# EAGLE design p02 (EAGLE 8.4.2)
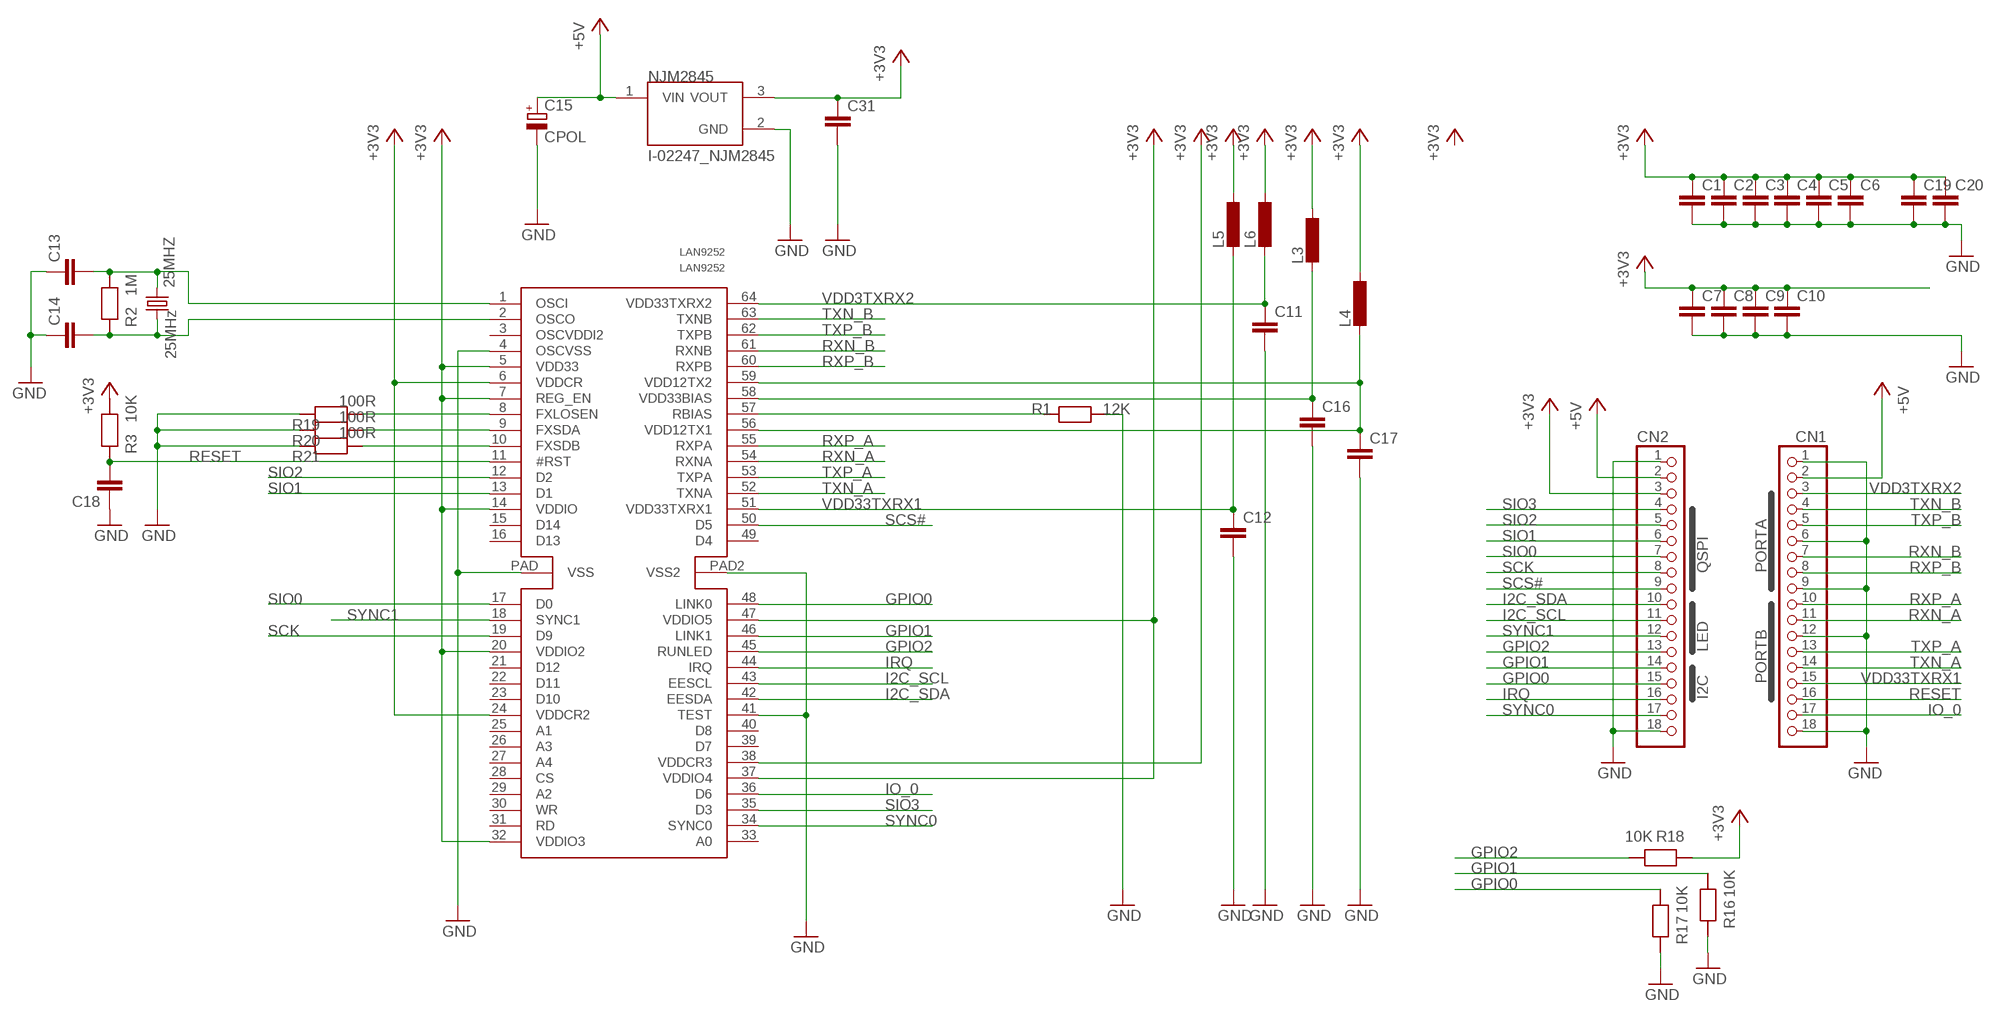
[diagram p0: schematic, sheet 1]

## Parts
25MHZ  25MHz  CRYSTALHC49S  [HC49/S]
C1  C_1068  [C0603]
C2  C_1068  [C0603]
C3  C_1068  [C0603]
C4  C_1068  [C0603]
C5  C_1068  [C0603]
C6  C_1068  [C0603]
C7  C_1068  [C0603]
C8  C_1068  [C0603]
C9  C_1068  [C0603]
C10  C_1068  [C0603]
C11  C_1068  [C0603]
C12  C_1068  [C0603]
C13  C_1068  [C0603]
C14  C_1068  [C0603]
C15  CPOL  [153CLV-0605]
C16  C_1068  [C0603]
C17  C_1068  [C0603]
C18  C_1068  [C0603]
C19  C_2012  [C0805K]
C20  C_2012  [C0805K]
C31  C_1068  [C0603]
CN1  PINHD-1X18  [1X18]
CN2  PINHD-1X18  [1X18]
L3  L-EUL2012C  [L2012C]
L4  L-EUL2012C  [L2012C]
L5  L-EUL2012C  [L2012C]
L6  L-EUL2012C  [L2012C]
LAN9252  LAN9252  [QFN-64_02]
NJM2845  I-02247_NJM2845  [TO252]
R1  12K  R_1068  [R0603]
R2  1M  R_1068  [R0603]
R3  10K  R_1068  [R0603]
R16  10K  R_1068  [R0603]
R17  10K  R_1068  [R0603]
R18  10K  R_1068  [R0603]
R19  100R  R_1068  [R0603]
R20  100R  R_1068  [R0603]
R21  100R  R_1068  [R0603]

## Nets
+3V3: C1.1 C2.1 C3.1 C4.1 C5.1 C6.1 C7.1 C8.1 C9.1 C10.1 C19.1 C20.1 C31.1 CN2.3 L3.1 L4.1 L5.1 L6.1 LAN9252.5(VDD33) LAN9252.6(VDDCR) LAN9252.7(REG_EN) LAN9252.14(VDDIO) LAN9252.20(VDDIO2) LAN9252.24(VDDCR2) LAN9252.32(VDDIO3) LAN9252.37(VDDIO4) LAN9252.38(VDDCR3) LAN9252.47(VDDIO5) NJM2845.3(VOUT) R3.2 R18.1
+5V: C15.+ CN1.2 CN2.2 NJM2845.1(VIN)
GND: C1.2 C2.2 C3.2 C4.2 C5.2 C6.2 C7.2 C8.2 C9.2 C10.2 C11.2 C12.2 C13.1 C14.1 C15.- C16.2 C17.2 C18.1 C19.2 C20.2 C31.2 CN1.1 CN1.6 CN1.9 CN1.12 CN1.18 CN2.1 CN2.18 LAN9252.4(OSCVSS) LAN9252.41(TEST) LAN9252.PAD2(VSS2) LAN9252.PAD(VSS) NJM2845.2(GND) R1.1 R16.1 R17.1 R19.1 R20.1 R21.1
GPIO0: CN2.15 LAN9252.48(LINK0) R17.2
GPIO1: CN2.14 LAN9252.46(LINK1) R16.2
GPIO2: CN2.13 LAN9252.45(RUNLED) R18.2
I2C_SCL: CN2.11 LAN9252.43(EESCL)
I2C_SDA: CN2.10 LAN9252.42(EESDA)
IO_0: CN1.17 LAN9252.36(D6)
IRQ: CN2.16 LAN9252.44(IRQ)
N$1: LAN9252.57(RBIAS) R1.2
N$2: LAN9252.8(FXLOSEN) R19.2
N$3: LAN9252.9(FXSDA) R20.2
N$4: 25MHZ.2 C13.2 LAN9252.1(OSCI) R2.2
N$5: C17.1 L4.2 LAN9252.56(VDD12TX1) LAN9252.59(VDD12TX2)
N$6: 25MHZ.1 C14.2 LAN9252.2(OSCO) R2.1
N$7: LAN9252.10(FXSDB) R21.2
N$8: C16.1 L3.2 LAN9252.58(VDD33BIAS)
RESET: C18.2 CN1.16 LAN9252.11(#RST) R3.1
RXN_A: CN1.11 LAN9252.54(RXNA)
RXN_B: CN1.7 LAN9252.61(RXNB)
RXP_A: CN1.10 LAN9252.55(RXPA)
RXP_B: CN1.8 LAN9252.60(RXPB)
SCK: CN2.8 LAN9252.19(D9)
SCS#: CN2.9 LAN9252.50(D5)
SIO0: CN2.7 LAN9252.17(D0)
SIO1: CN2.6 LAN9252.13(D1)
SIO2: CN2.5 LAN9252.12(D2)
SIO3: CN2.4 LAN9252.35(D3)
SYNC0: CN2.17 LAN9252.34(SYNC0)
SYNC1: CN2.12 LAN9252.18(SYNC1)
TXN_A: CN1.14 LAN9252.52(TXNA)
TXN_B: CN1.4 LAN9252.63(TXNB)
TXP_A: CN1.13 LAN9252.53(TXPA)
TXP_B: CN1.5 LAN9252.62(TXPB)
VDD3TXRX2: C11.1 CN1.3 L6.2 LAN9252.64(VDD33TXRX2)
VDD33TXRX1: C12.1 CN1.15 L5.2 LAN9252.51(VDD33TXRX1)
Unconnected: LAN9252.3(OSCVDDI2) LAN9252.15(D14) LAN9252.16(D13) LAN9252.21(D12) LAN9252.22(D11) LAN9252.23(D10) LAN9252.25(A1) LAN9252.26(A3) LAN9252.27(A4) LAN9252.28(CS) LAN9252.29(A2) LAN9252.30(WR) LAN9252.31(RD) LAN9252.33(A0) LAN9252.39(D7) LAN9252.40(D8) LAN9252.49(D4)

## Notes on the sheet
- QSPI | PORTA
- LED
- PORTB
- I2C

## Library data of the parts
25MHZ = crystal:CRYSTAL: CRYSTAL; OC_FARNELL: 1667008; OC_NEWARK: unknown
C1-C14 C16-C18 C31 = LAN9252:C_1068
C15 = MyPacklbr:CPOL
C19 C20 = LAN9252:C_2012
CN1 CN2 = pinhead:PINHD-1X18: PIN HEADER
L3-L6 = rcl:L-EU: INDUCTOR, European symbol
LAN9252 = LAN9252:LAN9252
NJM2845 = Akizuki:I-02247_NJM2845
R1-R3 R16-R21 = MyPacklbr:R_1068

## Board
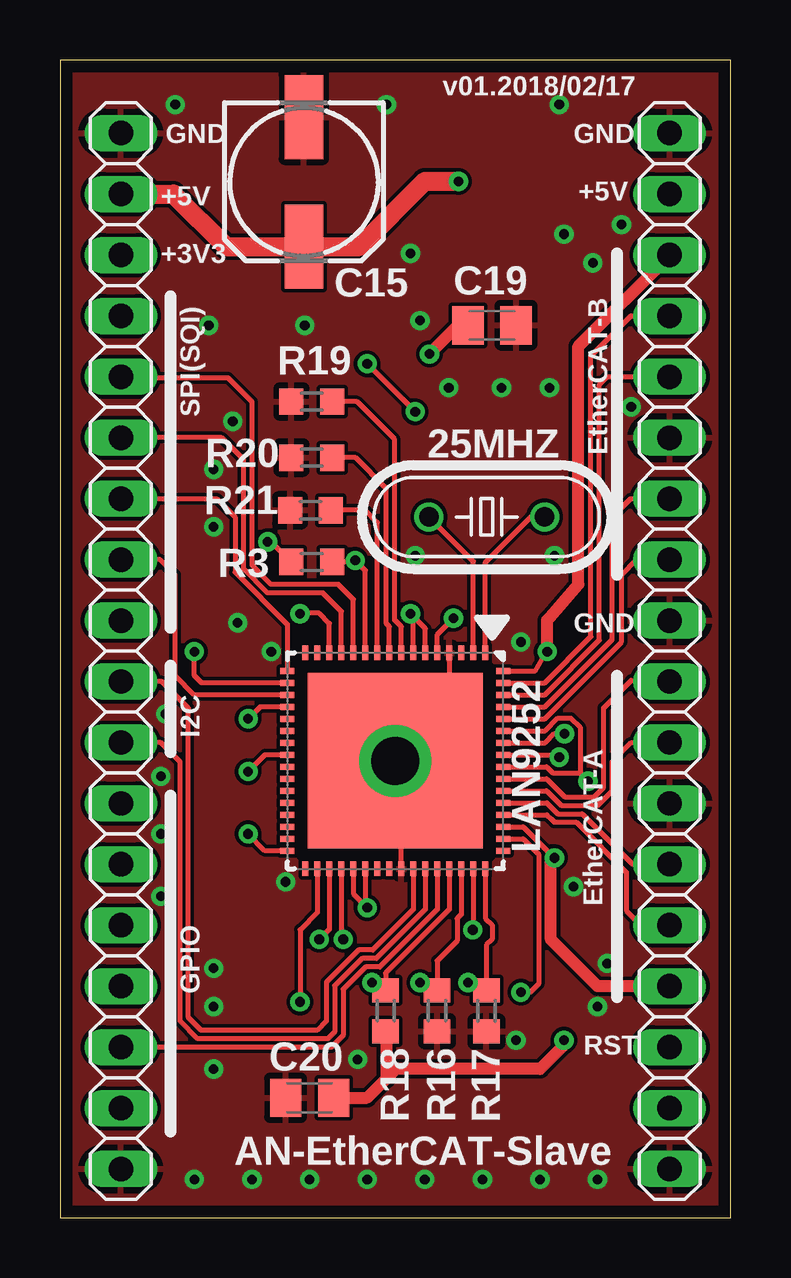
[diagram p1: board, top side]
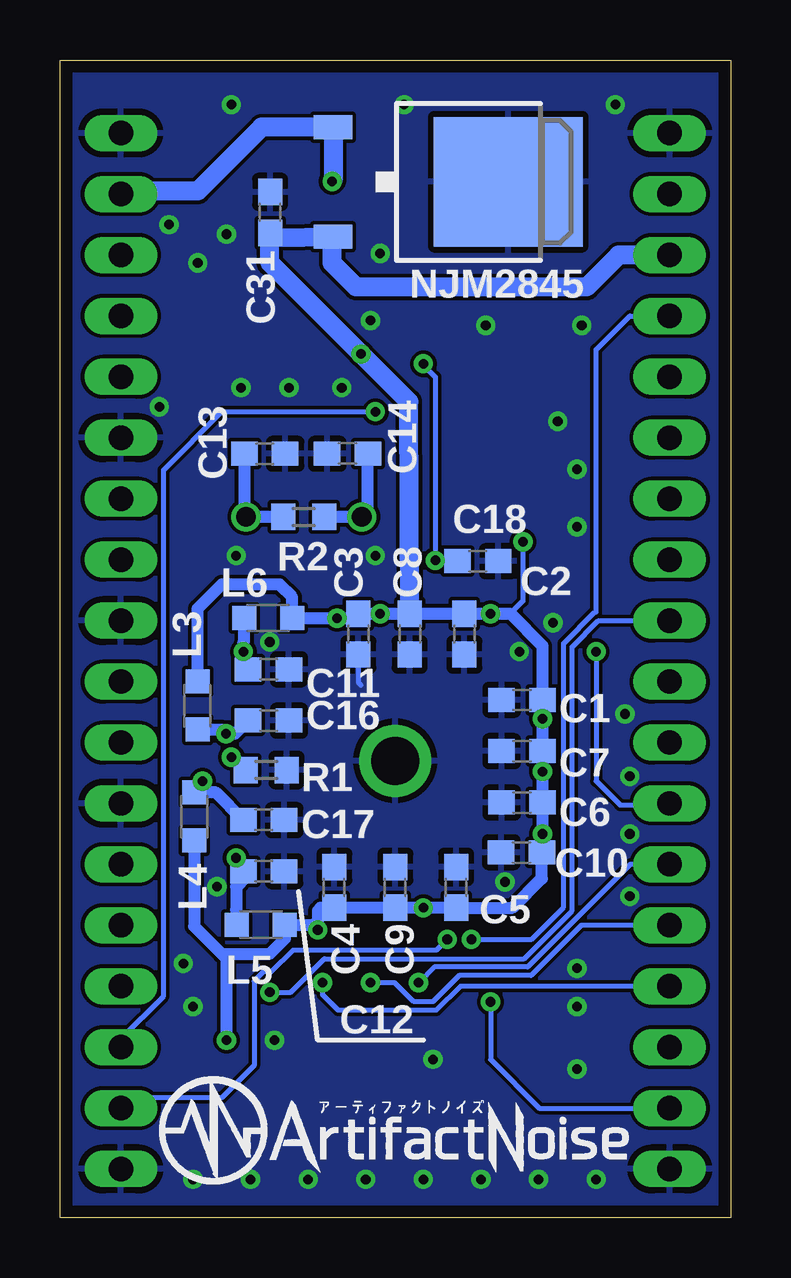
[diagram p2: board, bottom side, seen from below]

Size 27.94 x 48.26 mm. Coordinates in mm from the lower left corner, seen from the top.
Outline: 0,0 27.94,0 27.94,48.26 0,48.26 0,0
Copper layers (1*16): Top 0.035mm / dielectric 1.6mm / Bottom 0.035mm
Design rules "Elecrow_2-layer_PCB_eagle_rule": minimum track width 6mil, minimum drill 12mil, track to track 6mil, track to pad 6mil, pad to pad 6mil, via to via 8mil, smd to smd 0mil, copper to edge 20mil, drill to drill 10mil, minimum pad ring 6mil, minimum via ring 6mil, stop-mask expansion 0mil, vias tented up to drill 100mil, thermal gap 10mil
tKeepout: 1 lines
tRestrict: 4 lines

### Footprints (pad centres in the part's own frame; a part is rotated, then mirrored left to right if it is on the bottom)
HC49/S = drill 0.813: 1 -2.413,0; 2 2.413,0
C0603 = smd 1.1 x 1: 1 -0.85,0; 2 0.85,0
153CLV-0605 = smd 3.5 x 1.6: + 2.7,0; - -2.7,0
C0805K = smd 1.3 x 1.6: 1 -1,0; 2 1,0
1X18 = drill 1.016 long: 1 -21.59,0; 2 -19.05,0; 3 -16.51,0; 4 -13.97,0; 5 -11.43,0; 6 -8.89,0; 7 -6.35,0; 8 -3.81,0; 9 -1.27,0; 10 1.27,0; 11 3.81,0; 12 6.35,0; 13 8.89,0; 14 11.43,0; 15 13.97,0; 16 16.51,0; 17 19.05,0; 18 21.59,0
L2012C = smd 1 x 1: 1 -1,0; 2 1,0
QFN-64_02 = smd 0.6 x 0.25: 1 -4.5,3.75; 2 -4.5,3.25; 3 -4.5,2.75; 4 -4.5,2.25; 5 -4.5,1.75; 6 -4.5,1.25; 7 -4.5,0.75; 8 -4.5,0.25; 9 -4.5,-0.25; 10 -4.5,-0.75; 11 -4.5,-1.25; 12 -4.5,-1.75; 13 -4.5,-2.25; 14 -4.5,-2.75; 15 -4.5,-3.25; 16 -4.5,-3.75; 33 4.5,-3.75; 34 4.5,-3.25; 35 4.5,-2.75; 36 4.5,-2.25; 37 4.5,-1.75; 38 4.5,-1.25; 39 4.5,-0.75; 40 4.5,-0.25; 41 4.5,0.25; 42 4.5,0.75; 43 4.5,1.25; 44 4.5,1.75; 45 4.5,2.25; 46 4.5,2.75; 47 4.5,3.25; 48 4.5,3.75 | smd 0.25 x 0.6: 17 -3.75,-4.5; 18 -3.25,-4.5; 19 -2.75,-4.5; 20 -2.25,-4.5; 21 -1.75,-4.5; 22 -1.25,-4.5; 23 -0.75,-4.5; 24 -0.25,-4.5; 25 0.25,-4.5; 26 0.75,-4.5; 27 1.25,-4.5; 28 1.75,-4.5; 29 2.25,-4.5; 30 2.75,-4.5; 31 3.25,-4.5; 32 3.75,-4.5; 49 3.75,4.5; 50 3.25,4.5; 51 2.75,4.5; 52 2.25,4.5; 53 1.75,4.5; 54 1.25,4.5; 55 0.75,4.5; 56 0.25,4.5; 57 -0.25,4.5; 58 -0.75,4.5; 59 -1.25,4.5; 60 -1.75,4.5; 61 -2.25,4.5; 62 -2.75,4.5; 63 -3.25,4.5; 64 -3.75,4.5 | smd 7.3 x 7.3: PAD 0,0 | drill 2: PAD2 0,0
TO252 = smd 1 x 1.6: 1 -2.28,-4.8; 3 2.28,-4.8 | smd 5.4 x 6.2: 2 0,2.5
R0603 = smd 1 x 1.1: 1 -0.85,0; 2 0.85,0

### Placement (x,y rotation side)
25MHZ  17.78,29.21 0 top
C1  8.69,21.59 180 bottom
C2  11.09,24.33 270 bottom
C3  15.51,24.33 270 bottom
C4  16.51,13.77 90 bottom
C5  11.43,13.77 90 bottom
C6  8.69,17.31 180 bottom
C7  8.69,19.45 180 bottom
C8  13.37,24.33 270 bottom
C9  13.97,13.77 90 bottom
C10  8.71,15.23 180 bottom
C11  19.25,22.86 0 bottom
C12  19.45,14.44 0 bottom
C13  19.41,31.85 180 bottom
C14  15.96,31.85 0 bottom
C15  10.16,43.18 270 top
C16  19.25,20.72 0 bottom
C17  19.45,16.58 0 bottom
C18  10.53,27.37 180 bottom
C19  18,37.2 0 top
C20  10.4,5 180 top
C31  19.18,41.91 90 bottom
CN1  25.4,23.62 270 top
CN2  2.54,23.62 270 top
L3  22.21,21.35 270 bottom
L4  22.35,16.72 90 bottom
L5  19.57,12.21 180 bottom
L6  19.27,24.99 180 bottom
LAN9252  13.97,19.05 270 top
NJM2845  11.76,43.18 270 bottom
R1  19.35,18.66 180 bottom
R2  17.78,29.21 180 bottom
R3  10.49,27.34 180 top
R16  15.71,8.63 90 top
R17  17.77,8.62 90 top
R18  13.57,8.63 90 top
R19  10.49,34.02 0 top
R20  10.49,31.68 0 top
R21  10.44,29.49 0 top
U$1  [AN-LOGO2]  23.8,1.4 0 bottom

### Tracks (layer width: path | path; a pad name or v marks a point on that pad's centre or on a via)
+3V3  (via drill 0.4 pad 0.8)
  Top 0.2: LAN9252.6 15.22,24.56 v14.6,25.18 14.72,25.06 LAN9252.7 | LAN9252.5 15.72,24.31 v16.4,24.99 | LAN9252.47 17.22,12.82 v17.2,12 | LAN9252.38 12.72,13 | 12.72,13 v12.8,12.92 | LAN9252.37 12.22,13.5 12.72,13 | LAN9252.32 8.54,15.3 v7.84,16 | LAN9252.24 8.54,19.3 v7.84,18.6 | LAN9252.20 8.34,21.3 v7.84,20.8 | R3.2 8.81,28.17 v8.65,28.17 | v10,25.18 10.02,25.2 10.8,25.2 11.22,24.78 LAN9252.14
  Top 0.5: R18.1 13.6,7.75 13.6,5.8 | v21,7.4 21,7.2 20,6.2 14,6.2 13.6,5.8 | C20.1 12.8,5 13.6,5.8 | C19.1 16.59,37.2 v15.39,36.01
  Bottom 0.2: v8.65,28.17 8.65,25.71 9.18,25.18
  Bottom 0.5: L3.1 22.21,25.39 21.2,26.4 18.8,26.4 18.27,25.87 L6.1 v16.4,24.99 15.7,24.99 C3.1 v14.6,25.18 C8.1 C2.1 v10,25.18 9.18,25.18 7.84,23.84 C1.1 v7.84,20.8 C7.1 v7.84,18.6 C6.1 v7.84,16 7.84,15.25 C10.1 7.86,14.14 9.08,12.92 C5.1 v12.8,12.92 C9.1 C4.1 17.08,12.92 17.2,12.8 v17.2,12 17.41,12.21 L5.1 18.57,11.63 19.2,11 21.2,11 | L4.1 22.35,12.15 21.2,11 | v21,7.4 21,10.8 21.2,11
  Bottom 0.8: CN2.3 4.67,40.13 6,38.8 15.6,38.8 16.6,39.8 16.6,40.86 NJM2845.3 18.92,40.86 C31.1 19.2,41.04 19.2,39.8 19.19,39.8 v15.39,36.01 13.41,34.02 C8.1
+5V  (via drill 0.4 pad 0.8)
  Top 0.8: CN2.2 4.73,42.67 6.92,40.48 C15.+ 12.48,40.48 15.2,43.2 v16.6,43.2
  Bottom 0.8: CN1.2 25.27,42.8 22.2,42.8 19.54,45.46 NJM2845.1 16.56,43.24 v16.6,43.2
GND  (via drill 0.4 pad 0.8)
  Top 0.2: 14.06,19.14 15.72,20.8 | 15.72,20.8 16.2,20.8 | LAN9252.4 16.22,21.3 15.72,20.8 | 14.06,19.14 LAN9252.PAD2 | LAN9252.41 14.22,18.98 14.06,19.14
  Bottom 0.2: C3.2 15.51,22.31 15.4,22.2
  Bottom 0.5: 13.38,19.05 LAN9252.PAD2 13.57,19.45
  other vias: 6.4,8.8 6.4,10.4 5.6,1.6 8,1.6 10.4,1.6 12.8,1.6 15.2,1.6 17.6,1.6 20,1.6 22.4,1.6 19,7.4 4.8,46.4 13.6,46.4 20.8,46.4 6.2,37.2 15,37.4 14.6,40.2 21,41 20.4,34.6 16.2,34.6 7.2,33.2 6.4,31.2 6.4,28.8 7.4,24.8 10.2,37.2 18.4,34.6 14.8,27.6 19.2,24 8.8,23.6 9.4,14 22.8,10.6 21.4,13.8 6.4,6.2 12.4,6.6 22.4,8.8 4.2,18.4 4.4,21 4.2,16 4.2,13.4 23.8,33.8 23.4,41.4 22.2,39.8 20.6,27.6
  pour Bottom: 0,0 0,48.4 28,48.4 28,0
  pour Top: 0,0 0,48.4 28,48.4 28,0
GPIO0  (via drill 0.4 pad 0.8)
  Top 0.2: LAN9252.48 17.72,12.48 18,12.2 18,11.6 17.77,11.37 17.77,9.8 | 17.77,9.8 R17.2 | v17,9.8 17.77,9.8
  Bottom 0.2: CN2.15 11.25,9.65 12.25,8.65 16.35,8.65 17,9.29 v17,9.8
GPIO1  (via drill 0.4 pad 0.8)
  Top 0.2: 15.71,9.8 15.71,10.71 16.55,11.55 16.55,12.47 16.72,12.64 LAN9252.46 | 15.71,9.8 R16.2 | v15,9.8 15.71,9.8
  Bottom 0.2: CN2.14 6.21,12.19 8.31,10.1 11.3,10.1 12.4,9 13.2,9 14,9.8 v15,9.8
GPIO2  (via drill 0.4 pad 0.8)
  Top 0.2: 13.57,9.8 13.57,10.2 16.18,12.81 16.2,12.82 16.22,12.85 LAN9252.45 | 13.57,9.8 R18.2 | v13,9.8 13.57,9.8
  Bottom 0.2: v13,9.8 12.35,10.45 8.45,10.45 4.17,14.73 CN2.13
I2C_SCL
  Top 0.2: CN2.11 4.19,19.81 5,19 5,12.6 5,12.4 5,8.2 5.74,7.46 11.17,7.46 11.45,7.75 11.45,9.67 12.58,10.8 13.18,10.8 15.22,12.85 LAN9252.43
I2C_SDA
  Top 0.2: CN2.10 4.25,22.35 5.35,21.25 5.35,8.35 5.88,7.82 10.71,7.82 11.1,8.2 11.1,9.81 12.44,11.16 13.03,11.16 14.72,12.85 LAN9252.42
IO_0  (via drill 0.4 pad 0.8)
  Top 0.2: LAN9252.36 11.72,11.69 v11.8,11.61
  Bottom 0.2: v11.8,11.61 12.26,11.15 18.23,11.15 19.13,10.25 19.47,10.25 19.85,9.87 19.85,6.35 21.2,5 24.97,5 CN1.17
IRQ
  Top 0.2: CN2.16 11.31,7.11 11.8,7.6 11.8,9.52 12.73,10.45 13.32,10.45 15.72,12.85 LAN9252.44
N$1  (via drill 0.4 pad 0.8)
  Top 0.2: LAN9252.57 20.7,19.3 v20.8,19.2
  Bottom 0.5: R1.2 20.26,18.66 v20.8,19.2
N$2
  Top 0.2: LAN9252.8 14.22,24.64 13.95,24.91 13.95,32.45 12.38,34.02 R19.2
N$3
  Top 0.2: LAN9252.9 13.72,24.64 13.6,24.76 13.6,30.41 12.32,31.68 R20.2
N$4
  Top 0.2: LAN9252.1 17.72,27.32 19.61,29.21 25MHZ.2
  Bottom 0.5: R2.2 25MHZ.2 20.26,29.28 C13.2
N$5  (via drill 0.4 pad 0.8)
  Top 0.2: LAN9252.56 20.28,18.8 20.53,18.55 21.65,18.55 21.67,18.53 | 21.67,18.53 v22,18.2 | 21.67,18.53 21.67,20.45 21.29,20.83 20.75,20.83 20.22,20.3 LAN9252.59
  Bottom 0.2: v22,18.2 22.35,17.85 L4.2
  Bottom 0.5: C17.1 21.44,17.72 L4.2
N$6
  Top 0.2: LAN9252.2 17.22,27.36 25MHZ.1
  Bottom 0.5: C14.2 15.11,29.47 25MHZ.1 R2.1
N$7
  Top 0.2: LAN9252.10 13.22,28.98 12.71,29.49 R21.2
N$8  (via drill 0.4 pad 0.8)
  Top 0.2: LAN9252.58 20.22,19.8 20.6,20.18 v21.02,20.18
  Bottom 0.5: C16.1 20.64,20.18 v21.02,20.18 21.19,20.35 L3.2
RESET  (via drill 0.4 pad 0.8)
  Top 0.2: R3.1 12.24,27.34 v12.3,27.4 12.72,26.98 LAN9252.11 | v14.8,33.6 v12.8,35.6
  Bottom 0.2: CN1.16 25.4,7.46 23.62,9.23 23.62,31.18 21.2,33.6 v14.8,33.6 | v12.8,35.6 12.8,35.55 12.3,35.05 v12.3,27.4 11.41,27.4 C18.2
RXN_A
  Top 0.2: LAN9252.54 20.28,17.8 20.89,17.2 22.42,17.2 23,17.78 23,19 23.81,19.81 CN1.11
RXN_B
  Top 0.2: CN1.7 23.77,29.97 23,29.2 23,24.1 20.2,21.3 LAN9252.61
RXP_A
  Top 0.2: LAN9252.55 20.28,18.3 21.03,17.55 22.27,17.55 22.65,17.93 22.65,21.25 23.8,22.4 25.35,22.4 CN1.10
RXP_B
  Top 0.2: LAN9252.60 20.2,20.8 23.4,24 23.4,26.8 24.03,27.43 CN1.8
SCK
  Top 0.2: CN2.8 4.17,27.43 4.8,26.8 4.8,22.6 5.6,21.8 LAN9252.19
SCS#  (via drill 0.4 pad 0.8)
  Top 0.2: LAN9252.50 19.3,15.8 19.95,15.15 19.95,9.75 19.6,9.4 v19.2,9.4
  Bottom 0.2: CN2.9 5.51,24.89 6.6,23.8 6.6,12.8 8.6,10.8 16.92,10.8 18.32,9.4 v19.2,9.4
SIO0
  Top 0.2: CN2.7 6.52,29.97 7.29,29.2 7.29,26.91 9.47,24.73 LAN9252.17
SIO1
  Top 0.2: LAN9252.13 11.72,25.28 10.95,26.05 8.65,26.05 7.65,27.05 7.65,31.6 6.74,32.51 CN2.6
SIO2
  Top 0.2: LAN9252.12 12.22,25.78 11.6,26.4 8.8,26.4 8,27.2 8,34 7,35 2.59,35 CN2.5
SIO3  (via drill 0.4 pad 0.8)
  Top 0.2: LAN9252.35 11.22,12.03 v10.8,11.61
  Bottom 0.2: v10.8,11.61 8.29,11.61 6.95,12.95 6.95,23.95 5.65,25.24 5.6,25.24 5.6,36.19 4.2,37.59 CN2.4
SYNC0  (via drill 0.4 pad 0.8)
  Top 0.2: LAN9252.34 10.72,12.72 10,12 v10,9 | CN2.17 2.51,4.6
  Bottom 0.2: v10,9 10,6.6 7.97,4.57 CN2.17
SYNC1  (via drill 0.4 pad 0.8)
  Top 0.2: LAN9252.18 5.9,22.3 5.6,22.6 v5.6,23.6
  Bottom 0.2: v5.6,23.6 5.6,18.2 4.6,17.2 2.61,17.2 CN2.12
TXN_A
  Top 0.2: LAN9252.52 20.28,16.8 20.44,16.64 20.59,16.49 21.51,16.49 23.6,14.4 23.6,12.8 24.21,12.19 CN1.14
TXN_B
  Top 0.2: CN1.4 23.81,37.59 23.8,37.6 22.12,35.92 22.12,24.22 20.2,22.3 LAN9252.63
TXP_A
  Top 0.2: LAN9252.53 20.28,17.3 20.74,16.84 21.76,16.84 23.87,14.73 CN1.13
TXP_B
  Top 0.2: CN1.5 22.8,35.05 22.48,34.72 22.48,24.07 20.2,21.8 LAN9252.62
VDD3TXRX2  (via drill 0.4 pad 0.8)
  Top 0.2: LAN9252.64 19.8,22.8 20.1,23.3 v20.3,23.6
  Top 0.5: v20.3,23.6 20.3,24.9 21.6,26.4 21.6,36.33 CN1.3
  Bottom 0.5: C11.1 v20.3,23.6 20.3,23.9 20.27,24.07 L6.2
VDD33TXRX1  (via drill 0.4 pad 0.8)
  Top 0.2: LAN9252.51 19.3,16.3 v20.6,15
  Top 0.5: CN1.15 22.4,9.65 20.45,11.6 20.45,14.85 v20.6,15
  Bottom 0.2: v20.6,15 20.3,14.7 C12.1
  Bottom 0.5: C12.1 20.2,14.34 20.2,14.2 20.6,13.8 20.6,12.84 L5.2

### Text on the board
tPlace: v01.2018/02/17 | GND | GND | +5V | +5V | +3V3 | SPI(SQI) | EtherCAT-B | GND | I2C | EtherCAT-A | GPIO | RST | AN-EtherCAT-Slave
tDocu: PROJECT : AN-EtherCAT-Slave | VERSON : v1.0 | Width : 0.2 mm | Grid : 0.2 mm | Via : 0.8 mm | Drill : 0.4 mm | Font : 1.2 mm
tPCB-ID: AN-EtherCAT-Slave
bPCB-ID: AN-EtherCAT-Slave
tTOP-LAYERDESC: TOP
bBOTTOM-LAYERDESC: BOTTOM
tSILK-LAYERDESC: TOP-SILK
bSILK-LAYERDESC: BOTTOM-SILK
tSTOP-LAYERDESC: TOP-SOLDERMASK
bSTOP-LAYERDESC: BOTTOM-SOLDERMASK
tMETALMASK-LAYERDESC: TOP-METALMASK
bMERALMASK-LAYERDESC: BOTTOM-METALMASK
DRILL-LIST-LAYERDESC: DRILL